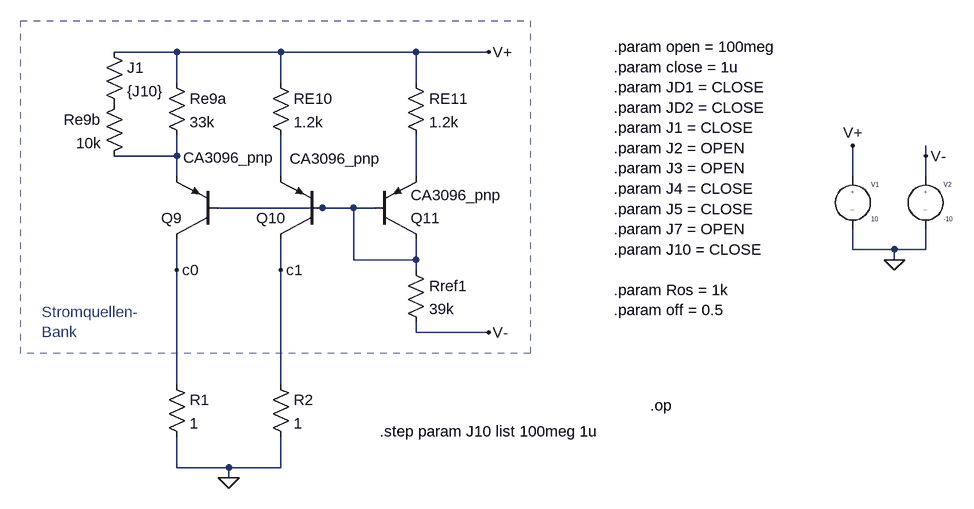
[diagram p0: schematic Stromquellenbank_op.asc]
Stromquellenbank_op.asc, the LTspice schematic file:
Version 4
SHEET 1 880 680
WIRE -1088 -144 -1184 -144
WIRE -928 -144 -1088 -144
WIRE -720 -144 -928 -144
WIRE -608 -144 -720 -144
WIRE -1088 -96 -1088 -144
WIRE -928 -96 -928 -144
WIRE -720 -96 -720 -144
WIRE -1088 16 -1088 -16
WIRE -1088 16 -1184 16
WIRE 64 16 64 0
WIRE -1088 48 -1088 16
WIRE -928 48 -928 -16
WIRE -720 48 -720 -16
WIRE -48 48 -48 0
WIRE 64 48 64 16
WIRE -864 96 -1024 96
WIRE -816 96 -864 96
WIRE -784 96 -816 96
WIRE -48 160 -48 128
WIRE 16 160 -48 160
WIRE 64 160 64 128
WIRE 64 160 16 160
WIRE -816 176 -816 96
WIRE -720 176 -720 144
WIRE -720 176 -816 176
WIRE 16 176 16 160
WIRE -1088 192 -1088 144
WIRE -928 192 -928 144
WIRE -720 192 -720 176
WIRE -720 288 -720 272
WIRE -608 288 -720 288
WIRE -1088 368 -1088 192
WIRE -928 368 -928 192
WIRE -1088 496 -1088 448
WIRE -1008 496 -1088 496
WIRE -928 496 -928 448
WIRE -928 496 -1008 496
WIRE -1008 512 -1008 496
FLAG -608 288 V-
FLAG -1088 192 c0
FLAG -928 192 c1
FLAG 16 176 0
FLAG -48 0 V+
FLAG 64 16 V-
FLAG -608 -144 V+
FLAG -1008 512 0
SYMBOL EIT_Semiconductors\\pnp -1024 144 R180
WINDOW 3 -87 125 Left 2
SYMATTR Value CA3096_pnp
SYMATTR InstName Q9
SYMBOL EIT_Semiconductors\\pnp -864 144 R180
WINDOW 3 -91 124 Left 2
SYMATTR Value CA3096_pnp
SYMATTR InstName Q10
SYMBOL EIT_Semiconductors\\pnp -784 144 M180
SYMATTR InstName Q11
SYMATTR Value CA3096_pnp
SYMBOL res -736 -112 R0
SYMATTR InstName RE11
SYMATTR Value 1.2k
SYMBOL res -944 -112 R0
SYMATTR InstName RE10
SYMATTR Value 1.2k
SYMBOL res -1104 -112 R0
SYMATTR InstName Re9a
SYMATTR Value 33k
SYMBOL res -1168 -80 M0
SYMATTR InstName Re9b
SYMATTR Value 10k
SYMBOL res -736 176 R0
SYMATTR InstName Rref1
SYMATTR Value 39k
SYMBOL res -1200 -160 R0
SYMATTR InstName J1
SYMATTR Value {J10}
SYMBOL source-V -48 32 R0
WINDOW 123 0 0 Left 2
WINDOW 39 0 0 Left 2
SYMATTR InstName V1
SYMATTR Value 10
SYMBOL source-V 64 32 R0
WINDOW 123 0 0 Left 2
WINDOW 39 0 0 Left 2
SYMATTR InstName V2
SYMATTR Value -10
SYMBOL res -1104 352 R0
SYMATTR InstName R1
SYMATTR Value 1
SYMBOL res -944 352 R0
SYMATTR InstName R2
SYMATTR Value 1
TEXT -1296 256 Left 2 ;Stromquellen-\nBank
TEXT -416 -152 Left 2 !.param open = 100meg\n.param close = 1u\n.param JD1 = CLOSE\n.param JD2 = CLOSE\n.param J1 = CLOSE\n.param J2 = OPEN\n.param J3 = OPEN\n.param J4 = CLOSE\n.param J5 = CLOSE\n.param J7 = OPEN\n.param J10 = CLOSE\n \n.param Ros = 1k\n.param off = 0.5
TEXT -360 400 Left 2 !.op
TEXT -776 440 Left 2 !.step param J10 list 100meg 1u
RECTANGLE Normal -544 320 -1328 -192 2

The netlist it stands for:
* Stromquellenbank_op.asc
Q9 c0 N004 N001 0 CA3096_pnp
Q10 c1 N004 N002 0 CA3096_pnp
Q11 N004 N004 N003 0 CA3096_pnp
RE11 V+ N003 1.2k
RE10 V+ N002 1.2k
Re9a V+ N001 33k
Re9b P001 N001 10k
Rref1 N004 V- 39k
R§J1 V+ P001 {J10}
V1 V+ 0 10
V2 V- 0 -10
R1 c0 0 1
R2 c1 0 1
.model NPN NPN
.model PNP PNP
.lib standard.bjt
* Stromquellen-
* Bank
.param open = 100meg
.param close = 1u
.param JD1 = CLOSE
.param JD2 = CLOSE
.param J1 = CLOSE
.param J2 = OPEN
.param J3 = OPEN
.param J4 = CLOSE
.param J5 = CLOSE
.param J7 = OPEN
.param J10 = CLOSE
.param Ros = 1k
.param off = 0.5
.op
.step param J10 list 100meg 1u
.backanno
.end